# Altium schematic sheet 电源控制板.SchDoc
size A4
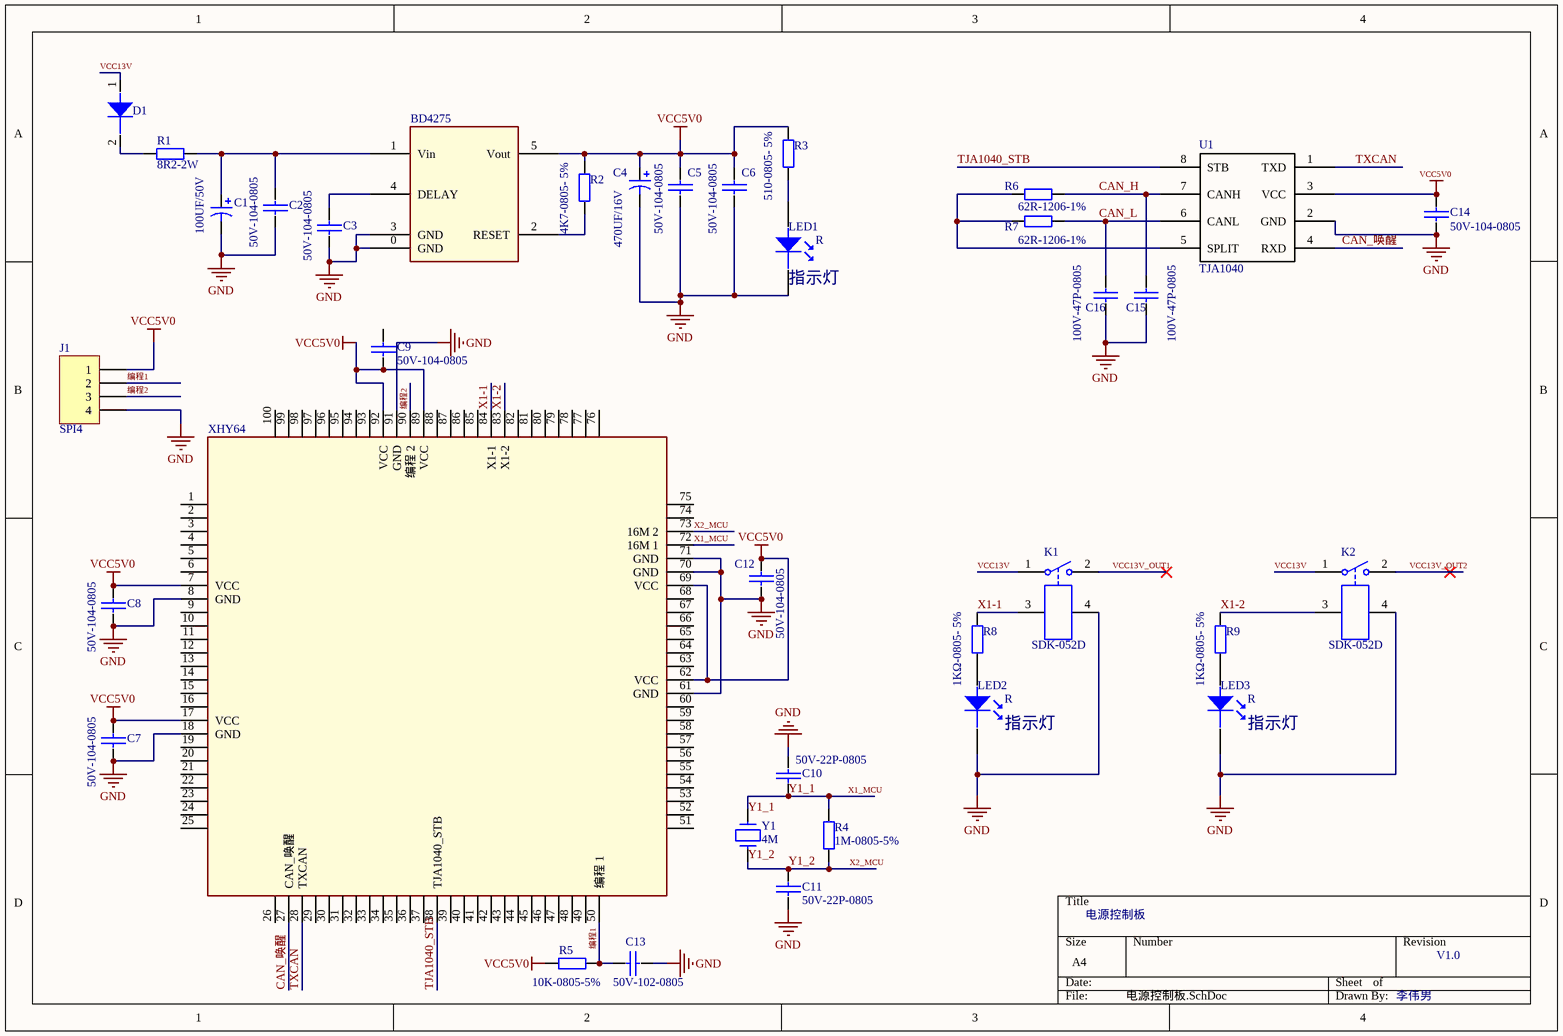
[diagram p0: 电源控制板.SchDoc]

## Parts
BD4275  BD4275  [TO-263]  (value not drawn)
C1  100UF/50V  [RB.1/.25]
C2  value 50V-104-0805  [C0805]  (hidden comment: 104)
C3  value 50V-104-0805  [C0805]  (hidden comment: 104)
C4  470UF/16V  [RB.1/.25]
C5  value 50V-104-0805  [C0805]  (hidden comment: 104)
C6  value 50V-104-0805  [C0805]  (hidden comment: 104)
C7  value 50V-104-0805  [C0805]  (hidden comment: 104)
C8  value 50V-104-0805  [C0805]  (hidden comment: 104)
C9  value 50V-104-0805  [C0805]  (hidden comment: 104)
C10  value 50V-22P-0805  [C0805]  (hidden comment: 22P)
C11  value 50V-22P-0805  [C0805]  (hidden comment: 22P)
C12  value 50V-104-0805  [C0805]  (hidden comment: 104)
C13  value 50V-102-0805  [C0805]  (hidden comment: 104)
C14  value 50V-104-0805  [C0805]  (hidden comment: 104)
C15  value 100V-47P-0805  [C0805]  (hidden comment: 47P-100V)
C16  value 100V-47P-0805  [C0805]  (hidden comment: 47P-100V)
D1  M7  [M7-A]  (value not drawn)
J1  SPI4  [HDR1X4]
K1  SDK-052D  [SDK-052D]
K2  SDK-052D  [SDK-052D]
LED1  R  [1206-2]
LED2  R  [1206-2]
LED3  R  [1206-2]
R1  8R2-2W  [2WR]
R2  value 4K7-0805- 5%  [0805]  (hidden comment: 4K7)
R3  value 510-0805- 5%  [0805_2]  (hidden comment: 510Ω)
R4  value 1M-0805-5%  [0805]  (hidden comment: 1M)
R5  value 10K-0805-5%  [0805]  (hidden comment: 10K)
R6  value 62R-1206-1%  [1206]  (hidden comment: 62R-J)
R7  value 62R-1206-1%  [1206]  (hidden comment: 62R-J)
R8  value 1KΩ-0805- 5%  [0805_2]  (hidden comment: 1KΩ)
R9  value 1KΩ-0805- 5%  [0805_2]  (hidden comment: 1KΩ)
U1  TJA1040  [SO-8]
XHY64  XHY64  [QUAD100]  (value not drawn)
Y1  4M  [16M]

## Nets
GND: BD4275.0(GND) BD4275.3(GND) C1.2 C2.1 C3.1 C4.2 C5.1 C6.1 C7.2 C8.2 C10.1 C11.2 C12.2 C13.1 C14.1 C15.1 C16.1 J1.4 K1.4 K2.4 LED1.2 LED2.2 LED3.2 U1.2(GND) XHY64.8(GND) XHY64.18(GND) XHY64.61(GND) XHY64.70(GND) XHY64.71(GND) XHY64.91(GND)
VCC5V0: BD4275.5(Vout) C4.1 C5.2 C6.2 C7.1 C8.1 C9.2 C12.1 C14.2 J1.1 R2.2 R3.2 R5.2 U1.3(VCC) XHY64.7(VCC) XHY64.17(VCC) XHY64.62(VCC) XHY64.69(VCC) XHY64.89(VCC) XHY64.92(VCC)
CAN_H: C15.2 R6.2 U1.7(CANH)
CAN_L: C16.2 R7.2 U1.6(CANL)
CAN_唤醒: U1.4(RXD) XHY64.27(CAN_唤醒)
TJA1040_STB: U1.8(STB) XHY64.38(TJA1040_STB)
TXCAN: U1.1(TXD) XHY64.28(TXCAN)
VCC13V: D1.1 K1.1 K2.1
VCC13V_OUT1: K1.2
VCC13V_OUT2: K2.2
X1-1: K1.3 R8.2 XHY64.84(X1-1)
X1-2: K2.3 R9.2 XHY64.83(X1-2)
X1_MCU: C10.2 R4.2 XHY64.72(16M_1) Y1.2  [also labelled Y1_1]
X2_MCU: C11.1 R4.1 XHY64.73(16M_2) Y1.1  [also labelled Y1_2]
编程1: C13.2 J1.2 R5.1 XHY64.50(编程_1)
编程2: J1.3 XHY64.90(编程_2)
NetBD4275_1: BD4275.1(Vin) C1.1 C2.2 R1.2
NetBD4275_2: BD4275.2(RESET) R2.1
NetBD4275_4: BD4275.4(DELAY) C3.2
NetD1_2: D1.2 R1.1
NetLED1_1: LED1.1 R3.1
NetR6_1: R6.1 R7.1 U1.5(SPLIT)

Not connected (* = marked no-connect by the designer): C9 1; LED2 1; LED3 1; R8 1; R9 1; XHY64 1 2 3 4 5 6 9 10 11 12 13 14 15 16 19 20 21 22 23 24 25 26 29 30 31 32 33 34 35 36 37 39 40 41 42 43 44 45 46 47 48 49 51 52 53 54 55 56 57 58 59 60 63 64 65 66 67 68 74 75 76 77 78 79 80 81 82 85 86 87 88 93 94 95 96 97 98 99 100

## Notes on the sheet
- (near LED1) 指示灯
- (near LED2) 指示灯
- (near LED3) 指示灯
- 电源控制板
- V1.0
- 李伟男
- Labels drawn without touching a wire or pin: Y1_1

## Library data of the parts
C1 = C470UF035S: 100UF      50V
C2 C3 C5-C9 C12 C14 = C104_0805: 104     50V        10%   C0805
C4 = C470UF016S: 100UF      50V      CD10X10D5
C10 C11 = C22P_0805: 22P     50V        10%   C0805
C13 = C102_0805: 104     50V        10%   C0805
C15 C16 = C47P_100V_0805: 47P    100V        10%   C0805
D1 = TVS
J1 = Header 4: 单排针，Header, 4-Pin; LatestRevisionDate: 17-Jul-2002; LatestRevisionNote: Re-released for DXP Platform.; Publisher: Altium Limited
K1 K2 = Relay-SPST: Published: 24-Mar-1999; LatestRevisionDate: 17-Jul-2002; LatestRevisionNote: Re-released for DXP Platform.; PackageReference: MODULE4; Publisher: Altium Limited
LED1-LED3 = LED_R
R1 = R8R22W: 8R2                                2W
R2 = R4K7_0805_5%: 4K7     1/8W    5%   R0805
R3 = R4K7_0805_5%: 510Ω    5%   R0805
R4 = R1M_0805_5%: 1M    1/8W    5%   R0805
R5 = R10K_0805_5%: 10K     1/8W    5%   R0805
R6 R7 = R62R_1206_1%: 62R    1/4W     1%   R1206
R8 R9 = R4K7_0805_5%: 1KΩ    5%   R0805
U1 = TJA1042: CAN驱动芯片
Y1 = XTAL: 晶体，4M